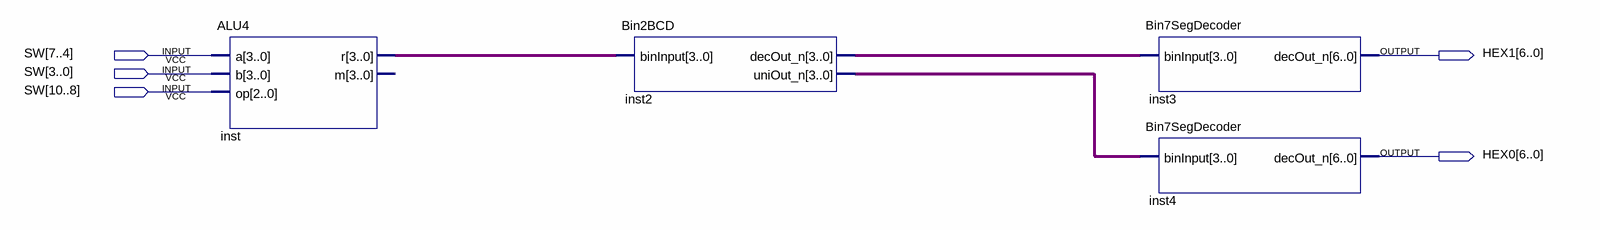
[diagram p0: schematic sheet]
// Quartus schematic ALU2Bin7SegDecoder4Bits.bdf as structural Verilog: 4 symbols, 5 pins
module ALU2Bin7SegDecoder4Bits (
  input  [10:0] SW,
  output [6:0] HEX1,
  output [6:0] HEX0
);

  wire [3:0] inst2_decout_n, inst2_uniout_n, inst_r;

  ALU4 inst (.a(SW[7:4]), .b(SW[3:0]), .op(SW[10:8]), .r(inst_r));  // open: m
  Bin2BCD inst2 (.binInput(inst_r), .decOut_n(inst2_decout_n), .uniOut_n(inst2_uniout_n));
  Bin7SegDecoder inst3 (.binInput(inst2_decout_n), .decOut_n(HEX1));
  Bin7SegDecoder inst4 (.binInput(inst2_uniout_n), .decOut_n(HEX0));
endmodule
